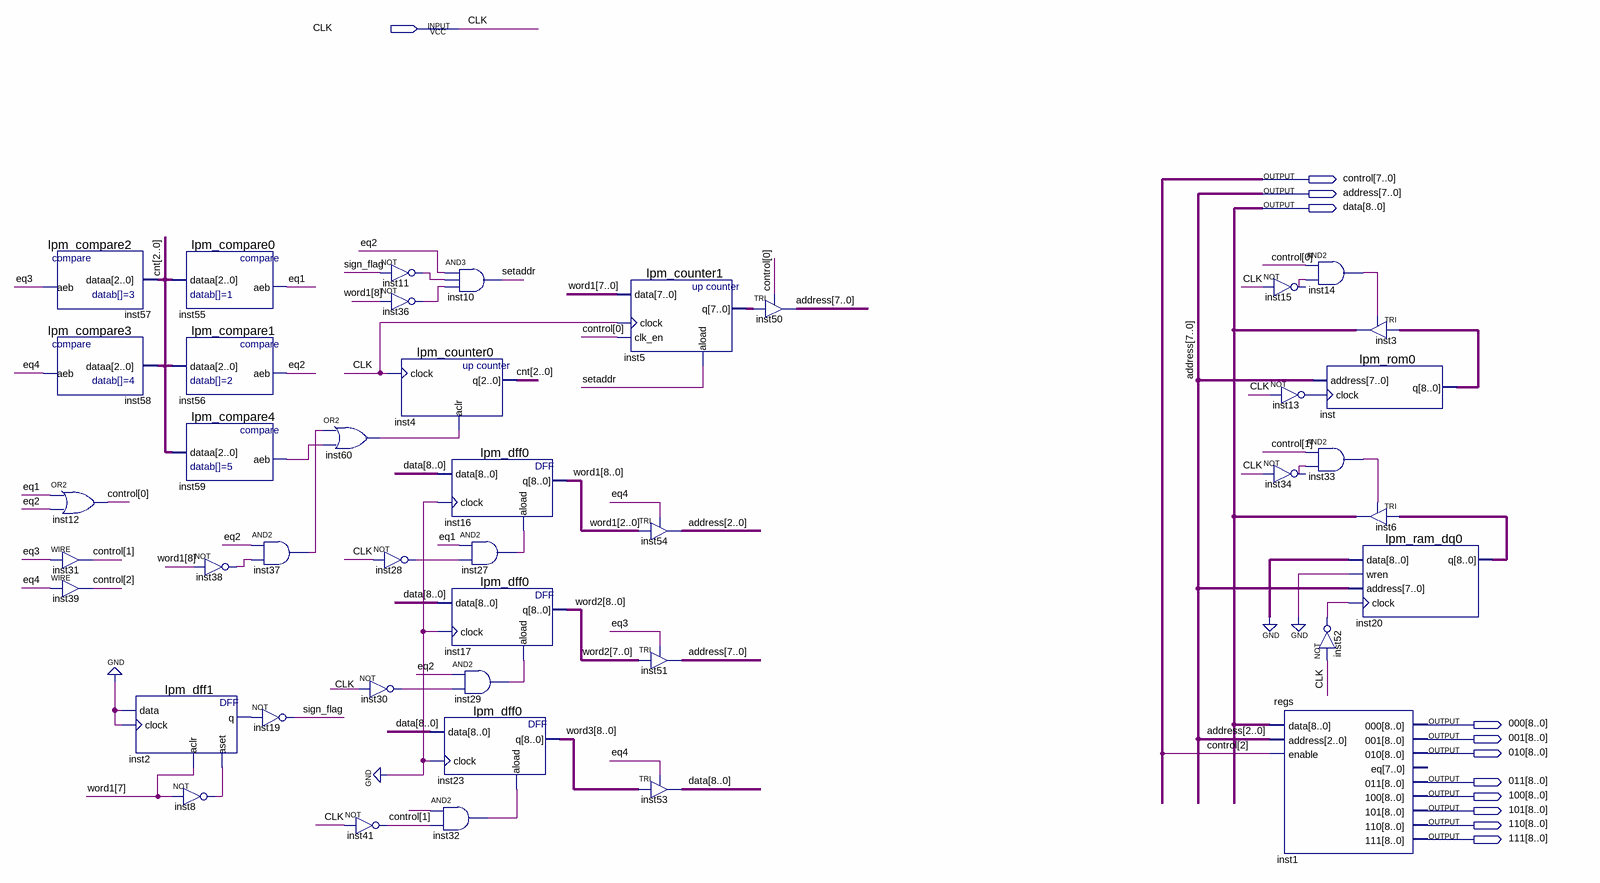
[diagram p0: schematic sheet]
// Quartus schematic main.bdf as structural Verilog: 43 symbols, 12 pins
module main (
  input  CLK,
  output [7:0] control,
  output [7:0] address,
  output [8:0] data,
  output [8:0] \000 ,
  output [8:0] \001 ,
  output [8:0] \010 ,
  output [8:0] \011 ,
  output [8:0] \100 ,
  output [8:0] \101 ,
  output [8:0] \110 ,
  output [8:0] \111 
);

  wire eq1, eq2, eq3, eq4, inst2_q, inst8_out, inst11_out, inst13_out, inst14_out, inst15_out, inst27_out,
       inst28_out, inst29_out, inst30_out, inst32_out, inst33_out, inst34_out, inst36_out, inst37_out,
       inst38_out, inst41_out, inst52_out, inst59_aeb, inst60_out, setaddr, sign_flag;
  wire [2:0] cnt;
  wire [7:0] inst5_q;
  wire [8:0] inst20_q, inst_q, word1, word2, word3;

  lpm_compare2 inst57 (.dataa(cnt), .aeb(eq3));
  lpm_compare3 inst58 (.dataa(cnt), .aeb(eq4));
  or inst12 (control[0], eq1, eq2);
  assign control[1] = eq3;  // WIRE inst31
  assign control[2] = eq4;  // WIRE inst39
  lpm_dff1 inst2 (.data(1'b0), .clock(1'b0), .aclr(word1[7]), .aset(inst8_out), .q(inst2_q));
  lpm_compare0 inst55 (.dataa(cnt), .aeb(eq1));
  lpm_compare1 inst56 (.dataa(cnt), .aeb(eq2));
  lpm_compare4 inst59 (.dataa(cnt), .aeb(inst59_aeb));
  not inst38 (inst38_out, word1[8]);
  not inst8 (inst8_out, word1[7]);
  and inst37 (inst37_out, eq2, inst38_out);
  not inst19 (sign_flag, inst2_q);
  or inst60 (inst60_out, inst37_out, inst59_aeb);
  not inst11 (inst11_out, sign_flag);
  not inst36 (inst36_out, word1[8]);
  not inst28 (inst28_out, CLK);
  not inst30 (inst30_out, CLK);
  not inst41 (inst41_out, CLK);
  lpm_counter0 inst4 (.clock(CLK), .aclr(inst60_out), .q(cnt));
  lpm_dff0 inst16 (.data(data), .clock(1'b0), .aload(inst27_out), .q(word1));
  lpm_dff0 inst17 (.data(data), .clock(1'b0), .aload(inst29_out), .q(word2));
  lpm_dff0 inst23 (.data(data), .clock(1'b0), .aload(inst32_out), .q(word3));
  and inst32 (inst32_out, control[1], inst41_out);
  and inst10 (setaddr, eq2, inst11_out, inst36_out);
  and inst27 (inst27_out, eq1, inst28_out);
  and inst29 (inst29_out, eq2, inst30_out);
  lpm_counter1 inst5 (.data(word1[7:0]), .clock(CLK), .clk_en(control[0]), .aload(setaddr), .q(inst5_q));
  TRI inst54[2:0] (.IN(word1[2:0]), .OE(eq4), .OUT(address[2:0]));
  TRI inst51[7:0] (.IN(word2[7:0]), .OE(eq3), .OUT(address));
  TRI inst53[8:0] (.IN(word3), .OE(eq4), .OUT(data));
  TRI inst50[7:0] (.IN(inst5_q), .OE(control[0]), .OUT(address));
  not inst15 (inst15_out, CLK);
  not inst13 (inst13_out, CLK);
  not inst34 (inst34_out, CLK);
  regs inst1 (
    .data(data), .address(address[2:0]), .enable(control[2]), .\000 (\000 ), .\001 (\001 ), .\010 (\010 ),
    .\011 (\011 ), .\100 (\100 ), .\101 (\101 ), .\110 (\110 ), .\111 (\111 ));  // open: eq
  and inst14 (inst14_out, control[0], inst15_out);
  TRI inst3[8:0] (.IN(inst_q), .OE(inst14_out), .OUT(data));
  lpm_rom0 inst (.address(address), .clock(inst13_out), .q(inst_q));
  and inst33 (inst33_out, control[1], inst34_out);
  TRI inst6[8:0] (.IN(inst20_q), .OE(inst33_out), .OUT(data));
  lpm_ram_dq0 inst20 (.data({9{1'b0}}), .wren(1'b0), .address(address), .clock(inst52_out), .q(inst20_q));
  not inst52 (inst52_out, CLK);
endmodule
